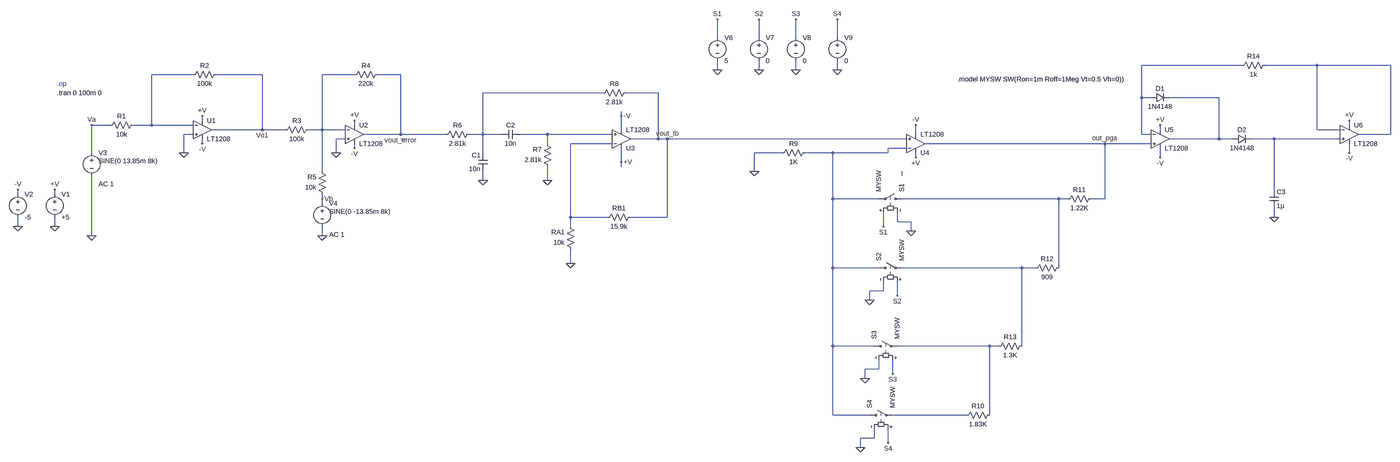
[diagram p0: schematic PROIECT INTEGRAL SIMULATOR 1.asc, whole sheet]
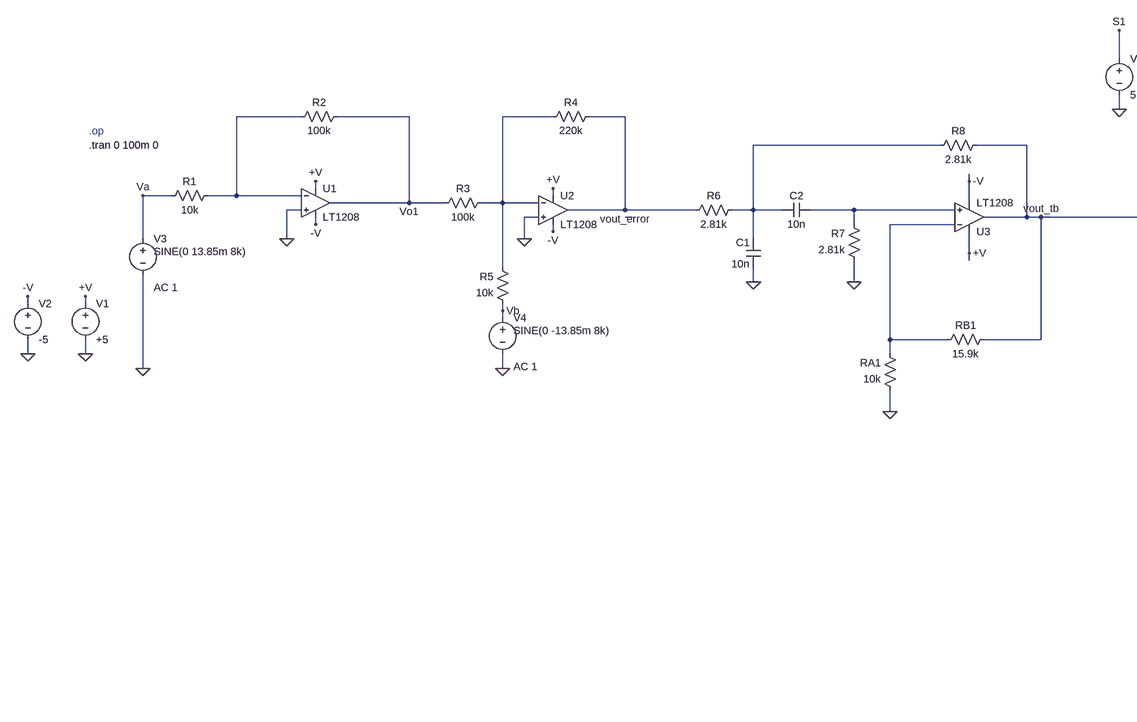
[diagram p1: schematic PROIECT INTEGRAL SIMULATOR 1.asc, part, row 1 of 1, column 1 of 2]
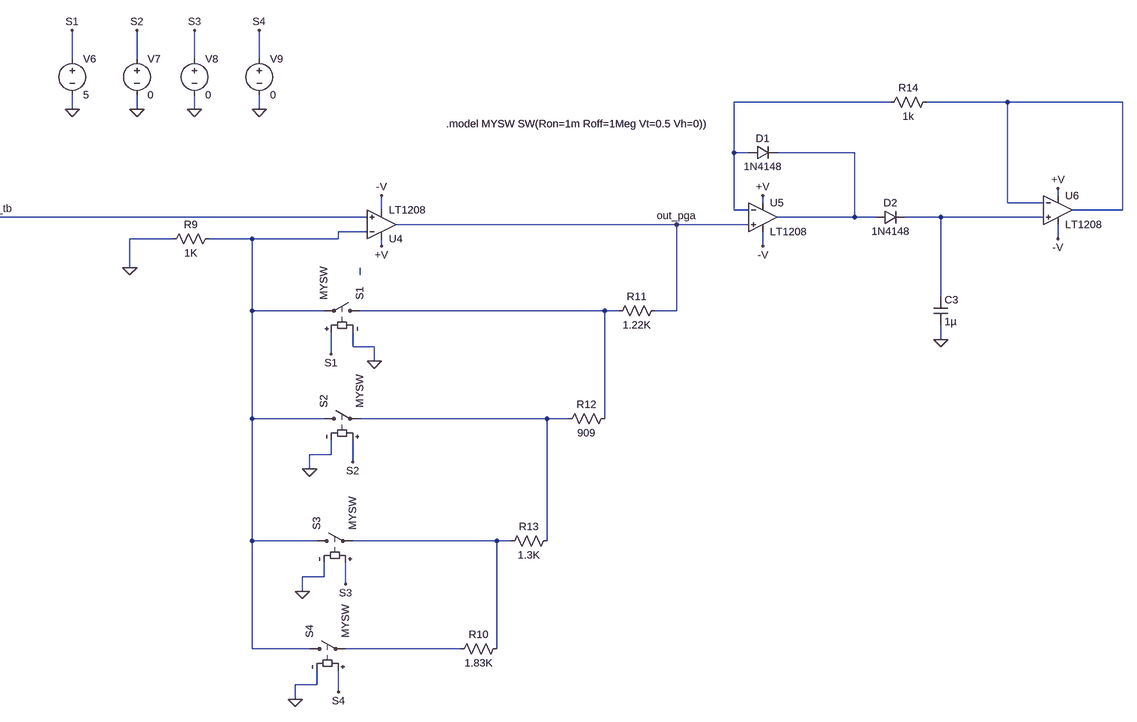
[diagram p2: schematic PROIECT INTEGRAL SIMULATOR 1.asc, part, row 1 of 1, column 2 of 2]
PROIECT INTEGRAL SIMULATOR 1.asc, the LTspice schematic file:
Version 4
SHEET 1 5844 2016
WIRE 2384 432 2384 368
WIRE 2528 432 2528 368
WIRE 2656 432 2656 368
WIRE 2800 432 2800 368
WIRE 4224 528 3856 528
WIRE 4576 528 4304 528
WIRE 4832 528 4576 528
WIRE 2384 544 2384 512
WIRE 2528 544 2528 512
WIRE 2656 544 2656 512
WIRE 2800 544 2800 512
WIRE 448 560 304 560
WIRE 688 560 528 560
WIRE 1008 560 896 560
WIRE 1168 560 1088 560
WIRE 1968 624 1552 624
WIRE 2160 624 2048 624
WIRE 3856 640 3856 528
WIRE 3888 640 3856 640
WIRE 4144 640 3952 640
WIRE 2032 704 2032 688
WIRE 480 720 480 704
WIRE 160 736 96 736
WIRE 304 736 304 560
WIRE 304 736 240 736
WIRE 448 736 304 736
WIRE 1008 736 1008 720
WIRE 4688 736 4688 720
WIRE 688 752 688 560
WIRE 688 752 512 752
WIRE 768 752 688 752
WIRE 896 752 896 560
WIRE 896 752 848 752
WIRE 976 752 896 752
WIRE 2032 752 2032 704
WIRE 3920 752 3920 736
WIRE 4576 752 4576 528
WIRE 4656 752 4576 752
WIRE 448 768 416 768
WIRE 1168 768 1168 560
WIRE 1168 768 1040 768
WIRE 1424 768 1168 768
WIRE 1552 768 1552 624
WIRE 1552 768 1504 768
WIRE 1616 768 1552 768
WIRE 1776 768 1680 768
WIRE 2000 768 1776 768
WIRE 3072 768 3072 736
WIRE 3856 768 3856 640
WIRE 3888 768 3856 768
WIRE 4832 768 4832 528
WIRE 4832 768 4720 768
WIRE 976 784 944 784
WIRE 1184 784 1168 784
WIRE 2160 784 2160 624
WIRE 2160 784 2064 784
WIRE 2192 784 2160 784
WIRE 3040 784 2192 784
WIRE 4144 784 4144 640
WIRE 4144 784 3952 784
WIRE 4192 784 4144 784
WIRE 4336 784 4256 784
WIRE 4656 784 4336 784
WIRE 480 800 480 784
WIRE 1776 800 1776 768
WIRE 2000 800 1856 800
WIRE 3728 800 3104 800
WIRE 3888 800 3728 800
WIRE 1008 816 1008 800
WIRE 3040 816 2976 816
WIRE 96 832 96 736
WIRE 416 832 416 768
WIRE 944 832 944 784
WIRE 1552 832 1552 768
WIRE 2608 832 2512 832
WIRE 2784 832 2688 832
WIRE 2976 832 2976 816
WIRE 2976 832 2784 832
WIRE 4688 832 4688 800
WIRE 3072 848 3072 832
WIRE 3920 848 3920 816
WIRE 2032 864 2032 816
WIRE 2032 880 2032 864
WIRE 896 896 896 752
WIRE 2512 896 2512 832
WIRE 3024 912 3024 896
WIRE 1552 928 1552 896
WIRE 1776 928 1776 880
WIRE 4336 960 4336 784
WIRE -160 976 -160 960
WIRE -32 976 -32 960
WIRE 896 992 896 976
WIRE 2784 992 2784 832
WIRE 2944 992 2784 992
WIRE 3568 992 3024 992
WIRE 3600 992 3568 992
WIRE 3728 992 3728 800
WIRE 3728 992 3680 992
WIRE 896 1008 896 992
WIRE 1856 1056 1856 800
WIRE 1984 1056 1856 1056
WIRE 2192 1056 2192 784
WIRE 2192 1056 2064 1056
WIRE 4336 1056 4336 1024
WIRE 3008 1072 3008 1040
WIRE 3056 1072 3008 1072
WIRE -160 1088 -160 1056
WIRE -32 1088 -32 1056
WIRE 1856 1088 1856 1056
WIRE 2960 1088 2960 1040
WIRE 3056 1104 3056 1072
WIRE 96 1120 96 912
WIRE 896 1120 896 1088
WIRE 1856 1216 1856 1168
WIRE 2784 1232 2784 992
WIRE 2944 1232 2784 1232
WIRE 3440 1232 3024 1232
WIRE 3488 1232 3440 1232
WIRE 3568 1232 3568 992
WIRE 2960 1312 2960 1280
WIRE 2960 1312 2912 1312
WIRE 3008 1328 3008 1280
WIRE 2912 1344 2912 1312
WIRE 2784 1504 2784 1232
WIRE 2928 1504 2784 1504
WIRE 3328 1504 3008 1504
WIRE 3360 1504 3328 1504
WIRE 3440 1504 3440 1232
WIRE 2944 1584 2944 1552
WIRE 2944 1584 2896 1584
WIRE 2992 1600 2992 1552
WIRE 2896 1616 2896 1584
WIRE 2784 1744 2784 1504
WIRE 2912 1744 2784 1744
WIRE 3248 1744 2992 1744
WIRE 3328 1744 3328 1504
WIRE 2928 1824 2928 1792
WIRE 2928 1824 2880 1824
WIRE 2976 1840 2976 1792
WIRE 2880 1856 2880 1824
FLAG -32 1088 0
FLAG 480 704 +V
FLAG -32 960 +V
FLAG 480 800 -V
FLAG -160 1088 0
FLAG -160 960 -V
FLAG 1008 720 +V
FLAG 1008 816 -V
FLAG 416 832 0
FLAG 944 832 0
FLAG 688 752 Vo1
FLAG 96 736 Va
FLAG 96 1120 0
FLAG 896 1120 0
FLAG 896 992 Vb
FLAG 1168 768 vout_error
FLAG 2032 704 -V
FLAG 2032 864 +V
FLAG 1776 928 0
FLAG 1552 928 0
FLAG 1856 1216 0
FLAG 2192 784 vout_tb
FLAG 2384 544 0
FLAG 2384 368 S1
FLAG 2528 544 0
FLAG 2528 368 S2
FLAG 2656 544 0
FLAG 2656 368 S3
FLAG 2800 544 0
FLAG 2800 368 S4
FLAG 2512 896 0
FLAG 3072 848 +V
FLAG 3072 736 -V
FLAG 2960 1088 S1
FLAG 3056 1104 0
FLAG 3008 1328 S2
FLAG 2912 1344 0
FLAG 2992 1600 S3
FLAG 2896 1616 0
FLAG 2976 1840 S4
FLAG 2880 1856 0
FLAG 4688 720 +V
FLAG 4688 832 -V
FLAG 4336 1056 0
FLAG 3728 800 out_pga
FLAG 3920 736 +V
FLAG 3920 848 -V
DATAFLAG 304 704 ""
DATAFLAG 944 800 ""
DATAFLAG 912 752 ""
DATAFLAG 1136 768 ""
DATAFLAG 416 784 ""
DATAFLAG 1328 768 ""
DATAFLAG 1584 768 ""
DATAFLAG 1856 768 ""
DATAFLAG 1936 800 ""
DATAFLAG 2128 784 ""
DATAFLAG 2864 832 ""
DATAFLAG 3472 800 ""
DATAFLAG 4688 720 ""
DATAFLAG 4688 816 ""
DATAFLAG 3920 736 ""
DATAFLAG 3920 832 ""
DATAFLAG 4832 752 ""
DATAFLAG 4400 784 ""
SYMBOL voltage -32 960 R0
WINDOW 123 0 0 Left 2
WINDOW 39 0 0 Left 2
SYMATTR InstName V1
SYMATTR Value +5
SYMBOL voltage -160 960 R0
WINDOW 123 0 0 Left 2
WINDOW 39 0 0 Left 2
SYMATTR InstName V2
SYMATTR Value -5
SYMBOL res 256 720 R90
WINDOW 0 0 56 VBottom 2
WINDOW 3 32 56 VTop 2
SYMATTR InstName R1
SYMATTR Value 10k
SYMBOL res 544 544 R90
WINDOW 0 0 56 VBottom 2
WINDOW 3 32 56 VTop 2
SYMATTR InstName R2
SYMATTR Value 100k
SYMBOL res 864 736 R90
WINDOW 0 0 56 VBottom 2
WINDOW 3 32 56 VTop 2
SYMATTR InstName R3
SYMATTR Value 100k
SYMBOL res 1104 544 R90
WINDOW 0 0 56 VBottom 2
WINDOW 3 32 56 VTop 2
SYMATTR InstName R4
SYMATTR Value 220k
SYMBOL res 912 992 R180
WINDOW 0 36 76 Left 2
WINDOW 3 36 40 Left 2
SYMATTR InstName R5
SYMATTR Value 10k
SYMBOL OpAmps\\LT1208 480 688 R0
SYMATTR InstName U1
SYMBOL OpAmps\\LT1208 1008 704 R0
SYMATTR InstName U2
SYMBOL voltage 96 816 R0
WINDOW 123 24 124 Left 2
WINDOW 39 0 0 Left 0
WINDOW 3 24 44 Left 2
SYMATTR Value2 AC 1
SYMATTR Value SINE(0 13.85m 8k)
SYMATTR InstName V3
SYMBOL voltage 896 992 R0
WINDOW 123 24 124 Left 2
WINDOW 39 0 0 Left 0
WINDOW 3 24 44 Left 2
SYMATTR Value2 AC 1
SYMATTR Value SINE(0 -13.85m 8k)
SYMATTR InstName V4
SYMBOL cap 1568 832 M0
SYMATTR InstName C1
SYMATTR Value 10n
SYMBOL cap 1616 784 R270
WINDOW 0 32 32 VTop 2
WINDOW 3 0 32 VBottom 2
SYMATTR InstName C2
SYMATTR Value 10n
SYMBOL res 2080 1040 R90
WINDOW 0 0 56 VBottom 2
WINDOW 3 32 56 VTop 2
SYMATTR InstName RB1
SYMATTR Value 15.9k
SYMBOL res 1872 1184 R180
WINDOW 0 36 76 Left 2
WINDOW 3 36 40 Left 2
SYMATTR InstName RA1
SYMATTR Value 10k
SYMBOL OpAmps\\LT1208 2032 848 M180
SYMATTR InstName U3
SYMBOL res 1520 752 R90
WINDOW 0 0 56 VBottom 2
WINDOW 3 32 56 VTop 2
SYMATTR InstName R6
SYMATTR Value 2.81k
SYMBOL res 1792 896 R180
WINDOW 0 36 76 Left 2
WINDOW 3 36 40 Left 2
SYMATTR InstName R7
SYMATTR Value 2.81k
SYMBOL res 1952 640 R270
WINDOW 0 32 56 VTop 2
WINDOW 3 0 56 VBottom 2
SYMATTR InstName R8
SYMATTR Value 2.81k
SYMBOL voltage 2384 416 R0
WINDOW 123 0 0 Left 2
WINDOW 39 0 0 Left 2
SYMATTR InstName V6
SYMATTR Value 5
SYMBOL voltage 2528 416 R0
WINDOW 123 0 0 Left 2
WINDOW 39 0 0 Left 2
SYMATTR InstName V7
SYMATTR Value 0
SYMBOL voltage 2656 416 R0
WINDOW 123 0 0 Left 2
WINDOW 39 0 0 Left 2
SYMATTR InstName V8
SYMATTR Value 0
SYMBOL voltage 2800 416 R0
WINDOW 123 0 0 Left 2
WINDOW 39 0 0 Left 2
SYMATTR InstName V9
SYMATTR Value 0
SYMBOL res 2704 816 R90
WINDOW 0 0 56 VBottom 2
WINDOW 3 32 56 VTop 2
SYMATTR InstName R9
SYMATTR Value 1K
SYMBOL OpAmps\\LT1208 3072 864 M180
SYMATTR InstName U4
SYMBOL res 3344 1728 R90
WINDOW 0 0 56 VBottom 2
WINDOW 3 32 56 VTop 2
SYMATTR InstName R10
SYMATTR Value 1.83K
SYMBOL res 3696 976 R90
WINDOW 0 0 56 VBottom 2
WINDOW 3 32 56 VTop 2
SYMATTR InstName R11
SYMATTR Value 1.22K
SYMBOL res 3584 1216 R90
WINDOW 0 0 56 VBottom 2
WINDOW 3 32 56 VTop 2
SYMATTR InstName R12
SYMATTR Value 909
SYMBOL res 3456 1488 R90
WINDOW 0 0 56 VBottom 2
WINDOW 3 32 56 VTop 2
SYMATTR InstName R13
SYMATTR Value 1.3K
SYMBOL sw 3040 992 M270
SYMATTR InstName S1
SYMATTR Value MYSW
SYMBOL sw 2928 1232 R270
SYMATTR InstName S2
SYMATTR Value MYSW
SYMBOL sw 2912 1504 R270
SYMATTR InstName S3
SYMATTR Value MYSW
SYMBOL sw 2896 1744 R270
SYMATTR InstName S4
SYMATTR Value MYSW
SYMBOL diode 3888 656 R270
WINDOW 0 32 32 VTop 2
WINDOW 3 0 32 VBottom 2
SYMATTR InstName D1
SYMATTR Value 1N4148
SYMBOL diode 4192 800 R270
WINDOW 0 32 32 VTop 2
WINDOW 3 0 32 VBottom 2
SYMATTR InstName D2
SYMATTR Value 1N4148
SYMBOL res 4320 512 R90
WINDOW 0 0 56 VBottom 2
WINDOW 3 32 56 VTop 2
SYMATTR InstName R14
SYMATTR Value 1k
SYMBOL cap 4320 960 R0
SYMATTR InstName C3
SYMATTR Value 1µ
SYMBOL OpAmps\\LT1208 4688 704 R0
SYMATTR InstName U6
SYMBOL OpAmps\\LT1208 3920 720 R0
SYMATTR InstName U5
TEXT -24 592 Left 2 ;.op
TEXT -24 624 Left 2 !.tran 0 100m 0
TEXT 3216 576 Left 2 !.model MYSW SW(Ron=1m Roff=1Meg Vt=0.5 Vh=0))

The netlist it stands for:
* PROIECT INTEGRAL SIMULATOR 1.asc
V1 +V 0 +5
V2 -V 0 -5
R1 N003 Va 10k
R2 Vo1 N003 100k
R3 N004 Vo1 100k
R4 vout_error N004 220k
R5 Vb N004 10k
XU1 0 N003 +V -V Vo1 LT1208  ; pins In+ In- V+ V- OUT
XU2 0 N004 +V -V vout_error LT1208  ; pins In+ In- V+ V- OUT
V3 Va 0 SINE(0 13.85m 8k) AC 1
V4 Vb 0 SINE(0 -13.85m 8k) AC 1
C1 N005 0 10n
C2 N005 N007 10n
RB1 vout_tb N010 15.9k
RA1 0 N010 10k
XU3 N007 N010 +V -V vout_tb LT1208  ; pins In+ In- V+ V- OUT
R6 N005 vout_error 2.81k
R7 0 N007 2.81k
R8 N005 vout_tb 2.81k
V6 S1 0 5
V7 S2 0 0
V8 S3 0 0
V9 S4 0 0
R9 N011 0 1K
XU4 vout_tb N011 +V -V out_pga LT1208  ; pins In+ In- V+ V- OUT
R10 N015 N016 1.83K
R11 out_pga N013 1.22K
R12 N013 N014 909
R13 N014 N015 1.3K
S1 N013 N011 S1 0 MYSW
S2 N011 N014 S2 0 MYSW
S3 N011 N015 S3 0 MYSW
S4 N011 N016 S4 0 MYSW
D1 N001 N006 1N4148
D2 N006 N009 1N4148
R14 N002 N001 1k
C3 N009 0 1µ
XU6 N009 N002 +V -V N002 LT1208  ; pins In+ In- V+ V- OUT
XU5 out_pga N001 +V -V N006 LT1208  ; pins In+ In- V+ V- OUT
.model D D
.lib standard.dio
* .op
.tran 0 100m 0
.model MYSW SW(Ron=1m Roff=1Meg Vt=0.5 Vh=0))
.backanno
.end